# Altium schematic sheet Fuente.SchDoc
size A4
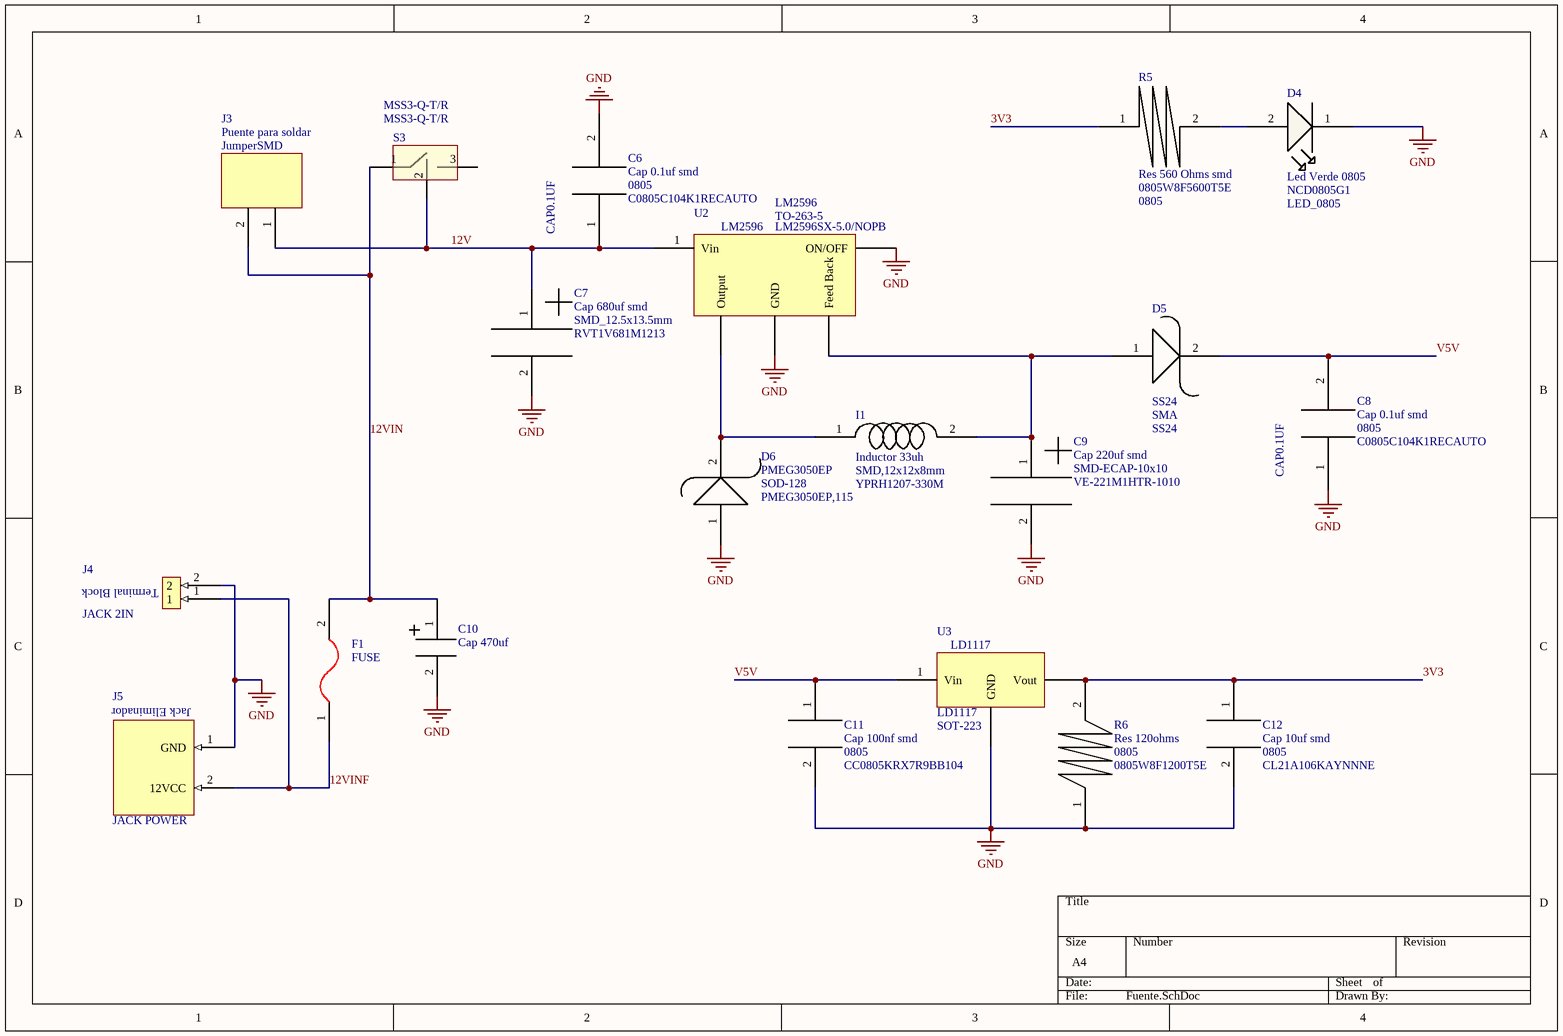
[diagram p0: Fuente.SchDoc]

## Parts
C6  Cap 0.1uf smd  Package: 0805  MFR.Part #: C0805C104K1RECAUTO  [CAP0.1UFSMD]
C7  Cap 680uf smd  Package: SMD_12.5x13.5mm  MFR.Part #: RVT1V681M1213  [CAP680UFSMD]
C8  Cap 0.1uf smd  Package: 0805  MFR.Part #: C0805C104K1RECAUTO  [CAP0.1UFSMD]
C9  Cap 220uf smd  Package: SMD-ECAP-10x10  MFR.Part #: VE-221M1HTR-1010  [CAP220UFSMD]
C10  Cap 470uf  [Cap 470uf]
C11  Cap 100nf smd  Package: 0805  MFR.Part #: CC0805KRX7R9BB104  [CAP100NFSMD]
C12  Cap 10uf smd  Package: 0805  MFR.Part #: CL21A106KAYNNNE  [CAP10UFSMD]
D4  Led Verde 0805  MFR.Part #: NCD0805G1  Package: LED_0805  [Led 0805 Verde]
D5  SS24  Package: SMA  [SS24]
D6  PMEG3050EP  Package: SOD-128  MFR.Part #: PMEG3050EP,115  [PMEG3050EP]
F1  FUSE  [FUSE]
I1  Inductor 33uh  Package: SMD,12x12x8mm  MFR.Part #: YPRH1207-330M  [Inductor 33UH]
J3  JumperSMD  [Jumper SMD]
J4  JACK 2IN  [Terminal Blocks 2in]
J5  JACK POWER  [POWER JACK]
R5  Res 560 Ohms smd  MFR.Part #: 0805W8F5600T5E  Package: 0805  [RES 560]
R6  Res 120ohms  Package: 0805  MFR.Part #: 0805W8F1200T5E  [RES 120OHMS]
S3  MSS3-Q-T/R  [MSS3-Q-T/R]
U2  LM2596  MFR.Part #: LM2596SX-5.0/NOPB  Package: TO-263-5  [LM2596]
U3  LD1117  Package: SOT-223  [LD1117]

## Nets
GND: C6.2 C7.2 C8.1 C9.2 C10.2 C11.2 C12.2 D4.1 D6.1 J4.2 J5.1(GND) J5.3(GND) R6.1 U2.3(GND) U2.5(ON/OFF) U3.2(GND)
3V3: C12.1 R5.1 R6.2 U3.3(Vout)
12V: C6.1 C7.1 J3.1 S3.2 U2.1(Vin)
12VIN: C10.1 F1.2 J3.2 S3.1
12VINF: F1.1 J4.1 J5.2(12VCC)
V5V: C8.2 C11.1 D5.2 U3.1(Vin)
NetC9_1: C9.1 D5.1 I1.2 U2.4(Feed_Back)
NetD4_2: D4.2 R5.2
NetD6_2: D6.2 I1.1 U2.2(Output)

Not connected (* = marked no-connect by the designer): S3 3

## Notes on the sheet
- (in symbol Cap 0.1uf smd) CAP0.1UF
- (in symbol JACK 2IN) Terminal Block
- (in symbol JACK 12V) Jack Eliminador
- (in symbol Jumper para soldar) Puente para soldar

## Library data of the parts
C6 C8 = Cap 0.1uf smd: 0.1uf
C7 = Cap 680uf smd: Cap 680uf
C9 = Cap 220uf smd: Cap 220uf
C10 = Cap 470uf: RVT1V471M1010; MFR.Part #: RVT1V471M1010; Package: SMD-ECAP-10x10
C11 = Cap 100nf smd: 100nf
C12 = Cap 10uf smd: 10uf
D4 = Led 0805 Verde
D5 = SS24: Schottky 40V 2A; MFR.Part #: SS24
D6 = PMEG3050EP: Diodo Schottky 30V 5A
F1 = FUSE HOLDER
I1 = Inductor 33uh: 33uh
J3 = Jumper para soldar
J4 = JACK 2IN: Pluggable Terminal Blocks WR-TBL Mod312 5.08mm 2Pin Opn Hztl PCBHdr; Manufacturer: Wurth Electronics; Manufacturer Part Number: 691312510002; Current Rating: 20 A; Mounting Angle: Horizontal; Mounting Method: PCB; Number of Positions: 2 Position; Voltage Rating: 300 V; Supplier 1: Mouser; RoHS: RoHS Compliant; Category: Pluggable Terminal Blocks; Stock 1: 413; Pricing 1: 1=0.528, 10=0.499, 50=0.475, 100=0.453, 500=0.429, 1000=0.416 (AUD); Color: Green; Connection Method: -; Contact Plating: Tin; Housing Material: Polybutylene Terephthalate (PBT); Packaging: Bulk; Product: Headers; Series: WR-TBL; Termination Style: Through Hole; Brand: Wurth Electronics; Contact Material: Brass; Flammability Rating: UL 94 V-0; Pitch: 5.08 mm; Wire Gauge Range: -; Wire Orientation: Horizontal; RoHS - Mouser: Y; Minimum Order Quantity: 1; Reeling: False; ComponentLink1URL: http://www.mouser.com/ds/2/445/6913125100xx-537850.pdf; ComponentLink1Description: http://www.mouser.com/ds/2/445/6913125100xx-537850.pdf; Supplier Part Number 1: 710-691312510002
J5 = JACK 12V: DC Power Connectors R/A POWER JACK; Manufacturer: Switchcraft; Manufacturer Part Number: RAPC712X; Connector Type: DC Power Jack; Current Rating: 5 A; Inside Contact Diameter: 2.5 mm; Mounting Angle: Right; Insulation Resistance: 30 MOhms; Supplier 1: Mouser; RoHS: RoHS Compliant; Category: DC Power Connectors; Stock 1: 23988; Pricing 1: 1=1.52, 10=1.49, 25=1.44, 50=1.35, 100=1.26, 200=1.25, 500=1.19, 1000=1.10, 2000=1.06 (AUD); Color: Black; Contact Plating: Nickel; Housing Material: Thermoplastic; Packaging: Bulk; Product: Jacks; Series: RAPC; Termination Style: Through Hole; Brand: Switchcraft; Contact Material: Brass; Flammability Rating: UL 94 V-0; Contact Gender: Female; Product Category: DC Jacks; Standard Pack Qty: 2500; RoHS - Mouser: Y; Minimum Order Quantity: 1; Reeling: False; ComponentLink1URL: http://www.mouser.com/ds/2/393/rapc712x_cd-371318.pdf; ComponentLink1Description: http://www.mouser.com/ds/2/393/rapc712x_cd-371318.pdf; Supplier Part Number 1: 502-RAPC712X
R6 = Res 120ohms: 120 ohms
S3 = MSS3-Q-T/R: Package: SW-SMD; MFR.Part #: MSS3-Q-T/R